# EAGLE design LTC4150 BOB V01 (EAGLE 6.4)
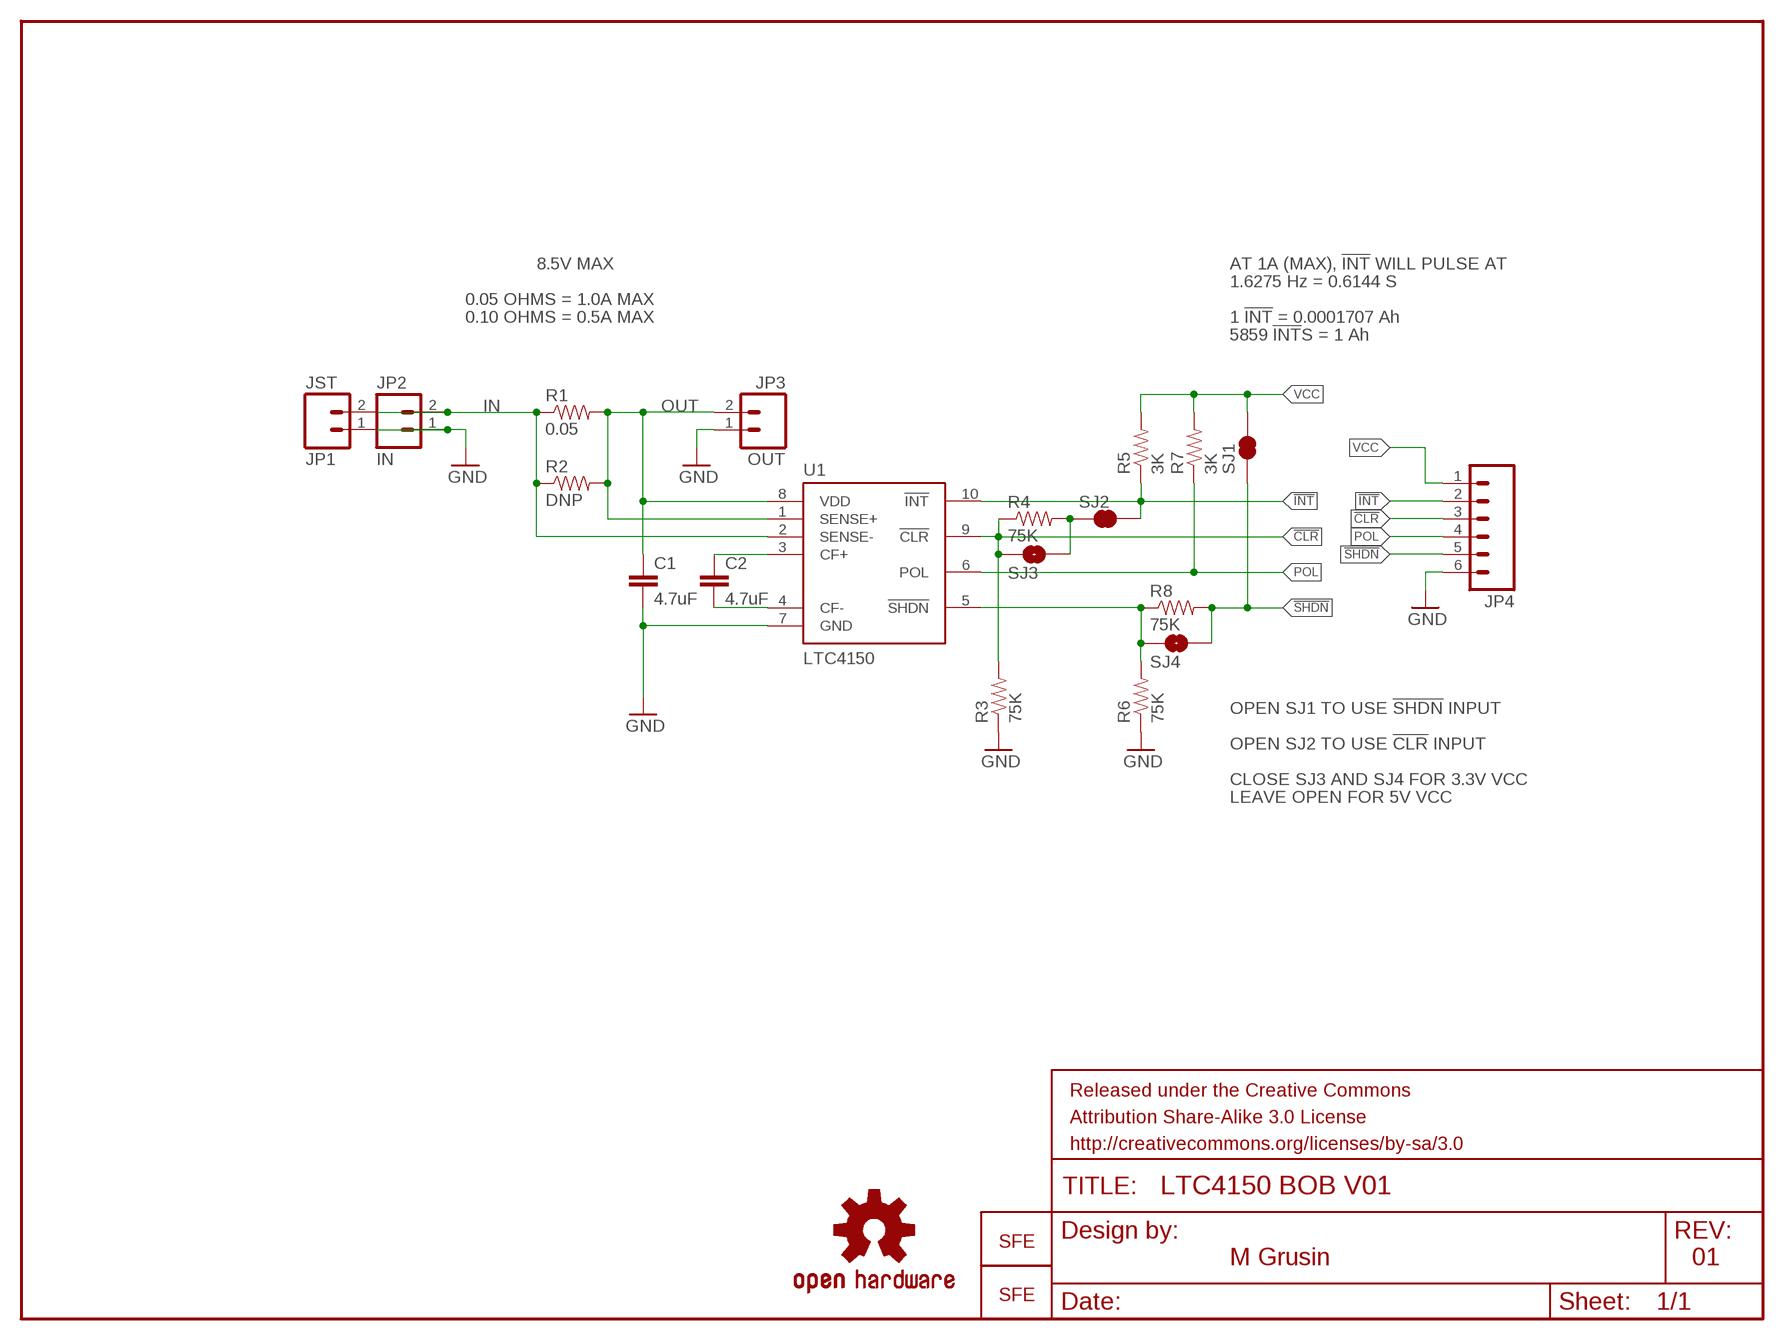
[diagram p0: schematic, sheet 1]

## Parts
C1  4.7uF  CAP0603-CAP  [0603-CAP]
C2  4.7uF  CAP0603-CAP  [0603-CAP]
FRAME1  FRAME-LETTER  [CREATIVE_COMMONS]
JP1  JST  M02-JST-2MM-SMT  [JST-2-SMD]
JP2  IN  M02PTH  [1X02]
JP3  OUT  M02PTH  [1X02]
JP4  M06SIP  [1X06]
LOGO1  OSHW-LOGOS  [OSHW-LOGO-S]
LOGO2  LOGO-SFENW2  [SFE-NEW-WEB]
LOGO3  LOGO-SFESK  [SFE-LOGO-FLAME]
R1  0.05  RESISTOR0805-RES  [0805]
R2  DNP  RESISTORAXIAL-0.3  [AXIAL-0.3]
R3  75K  RESISTOR0603-RES  [0603-RES]
R4  75K  RESISTOR0603-RES  [0603-RES]
R5  3K  RESISTOR0603-RES  [0603-RES]
R6  75K  RESISTOR0603-RES  [0603-RES]
R7  3K  RESISTOR0603-RES  [0603-RES]
R8  75K  RESISTOR0603-RES  [0603-RES]
SJ1  SOLDERJUMPERNC  [SJ_2S]
SJ2  SOLDERJUMPERNC  [SJ_2S]
SJ3  SOLDERJUMPERNO  [SJ_2S-NO]
SJ4  SOLDERJUMPERNO  [SJ_2S-NO]
U1  LTC4150  [MSOP10]

## Nets
!CLR!: JP4.3 R3.2 R4.1 SJ3.1 U1.9(!CLR!)
!INT!: JP4.2 R5.1 SJ2.2 U1.10(!INT!)
!SHDN!: JP4.5 R8.2 SJ1.2 SJ4.2
GND: C1.2 JP1.1 JP2.1 JP3.1 JP4.6 R3.1 R6.1 U1.7(GND)
IN: JP1.2 JP2.2 R1.1 R2.P$1 U1.2(SENSE-)
N$1: R4.2 SJ2.1 SJ3.2
N$3: C2.1 U1.3(CF+)
N$4: C2.2 U1.4(CF-)
N$9: R6.2 R8.1 SJ4.1 U1.5(!SHDN!)
OUT: C1.1 JP3.2 R1.2 R2.P$2 U1.1(SENSE+) U1.8(VDD)
POL: JP4.4 R7.1 U1.6(POL)
VCC: JP4.1 R5.2 R7.2 SJ1.1

## Notes on the sheet
- 8.5V MAX | AT 1A (MAX), !INT! WILL PULSE AT
- 1.6275 Hz = 0.6144 S
- 0.05 OHMS = 1.0A MAX
- 0.10 OHMS = 0.5A MAX | 1 !INT! = 0.0001707 Ah
- 5859 !INT!S = 1 Ah
- OPEN SJ1 TO USE !SHDN! INPUT
- OPEN SJ2 TO USE !CLR! INPUT
- CLOSE SJ3 AND SJ4 FOR 3.3V VCC
- LEAVE OPEN FOR 5V VCC
- M Grusin | 01

## Library data of the parts
C1 C2 = SparkFun-Passives:CAP: Capacitor Standard 0603 ceramic capacitor, and 0.1" leaded capacitor.
FRAME1 = SparkFun-Aesthetics:FRAME-LETTER: Schematic Frame Standard 8.5x11 US Letter frame
JP1 = SparkFun-Connectors:M02: Standard 2-pin 0.1" header. Use with - straight break away headers ( PRT-00116) - right angle break away headers (PRT-00553) - swiss pins (PRT-00743) - machine pins (PRT-00117) - female headers (PRT-00115) Molex polarized connector foot print use with: PRT-08233 with associated crimp pins and housings. 2.54_SCREWTERM for use with PRT-10571. 3.5mm Screw Terminal footprints for PRT-08084 5mm Screw Terminal footprints for use with PRT-08433; PROD_ID: CONN-08352
JP2 JP3 = SparkFun-Connectors:M02: Standard 2-pin 0.1" header. Use with - straight break away headers ( PRT-00116) - right angle break away headers (PRT-00553) - swiss pins (PRT-00743) - machine pins (PRT-00117) - female headers (PRT-00115) Molex polarized connector foot print use with: PRT-08233 with associated crimp pins and housings. 2.54_SCREWTERM for use with PRT-10571. 3.5mm Screw Terminal footprints for PRT-08084 5mm Screw Terminal footprints for use with PRT-08433
JP4 = SparkFun-Connectors:M06: Header 6 Standard 6-pin 0.1" header. Use with straight break away headers (SKU : PRT-00116), right angle break away headers (PRT-00553), swiss pins (PRT-00743), machine pins (PRT-00117), and female headers (PRT-00115). Molex polarized connector foot print use with SKU : PRT-08094 with associated crimp pins and housings. NOTES ON THE VARIANTS LOCK and LOCK_LONGPADS... This footprint was designed to help hold the alignment of a through-hole component (i.e. 6-pin header) while soldering it into place. You may notice that each hole has been shifted either up or down by 0.005 of an inch from it's more standard position (which is a perfectly straight line). This slight alteration caused the pins (the squares in the middle) to touch the edges of the holes. Because they are alternating, it causes a "brace" to hold the component in place. 0.005 has proven to be the perfect amount of "off-center" position when using our standard breakaway headers. Although looks a little odd when you look at the bare footprint, once you have a header in there, the alteration is very hard to notice. Also,if you push a header all the way into place, it is covered up entirely on the bottom side. This idea of altering the position of holes to aid alignment will be further integrated into the Sparkfun Library for other footprints. It can help hold any component with 3 or more connection pins.
LOGO1 = SparkFun-Aesthetics:OSHW-LOGO: Open Source Hardware Logo This logo indicates the piece of hardware it is found on incorporates a OSHW license and/or adheres to the definition of open source hardware found here: http://freedomdefined.org/OSHW
LOGO2 LOGO3 = SparkFun-Aesthetics:LOGO-SFE: Spark Fun Electronics PCB Logo This is the standard Spark Fun Electronics PCB logo.
R1-R8 = SparkFun-Passives:RESISTOR: Resistor Basic schematic elements and footprints for 0603, 1206, and PTH resistors.
SJ1 SJ3 SJ4 = mike-temp:SOLDERJUMPER: Solder Jumper Standard SMD solder jumper. Used to automate production. Two varients : Normally Open and Normally Closed are the same, but have different paste layers. NC will have a large amount of paste and should jumper during reflow.
SJ2 = SparkFun-Passives:SOLDERJUMPER: Solder Jumper Standard SMD solder jumper. Used to automate production. Two varients : Normally Open and Normally Closed are the same, but have different paste layers. NC will have a large amount of paste and should jumper during reflow.
U1 = mike-temp:LTC4150

## Board
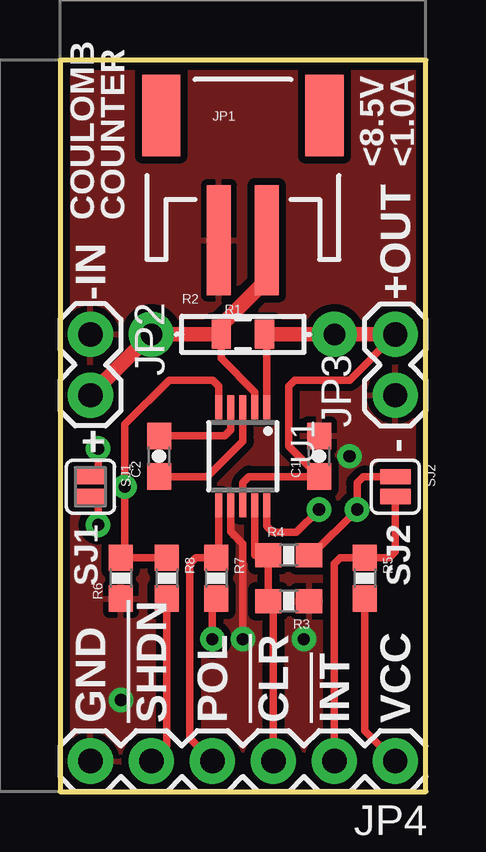
[diagram p1: board, top side]
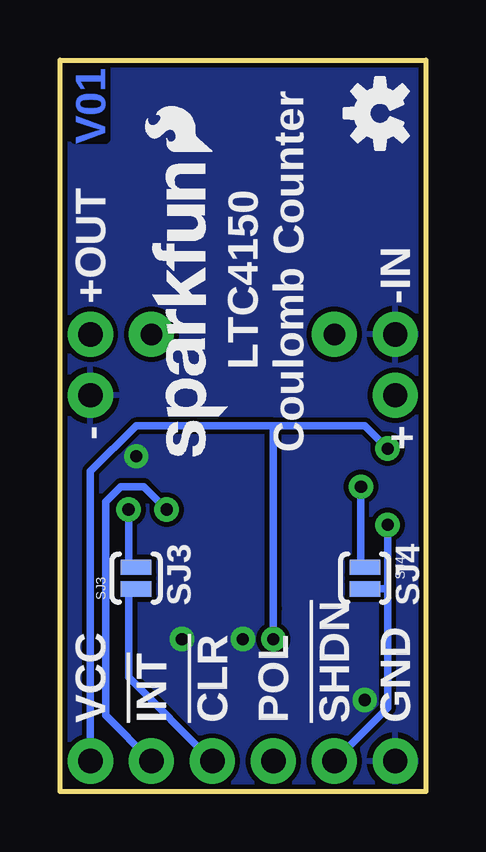
[diagram p2: board, bottom side, seen from below]

Size 15.24 x 30.48 mm. Coordinates in mm from the lower left corner, seen from the top.
Outline: 0,0 15.24,0 15.24,30.48 0,30.48 0,0
Copper layers (1*16): Top 0.035mm / dielectric 1.5mm / Bottom 0.035mm
Design rules "SparkFun": minimum track width 7mil, minimum drill 15mil, track to track 8mil, track to pad 8mil, pad to pad 8mil, via to via 8mil, smd to smd 8mil, copper to edge 8mil, drill to drill 8mil, minimum pad ring 12mil, minimum via ring 10mil, stop-mask expansion 4mil, vias tented up to drill 20mil, thermal gap 10mil

### Footprints (pad centres in the part's own frame; a part is rotated, then mirrored left to right if it is on the bottom)
0603-CAP = smd 1.1 x 1: 1 -0.85,0; 2 0.85,0
JST-2-SMD = smd 1 x 4.6: 1 -1,-3.7; 2 1,-3.7 | smd 1.6 x 3.4: NC1 -3.4,1.5; NC2 3.4,1.5
1X02 = drill 1.016 pad 1.88: 1 0,0; 2 2.54,0
1X06 = drill 1.016 pad 1.88: 1 0,0; 2 2.54,0; 3 5.08,0; 4 7.62,0; 5 10.16,0; 6 12.7,0
0805 = smd 0.8 x 1.2: 1 -0.9,0; 2 0.9,0
AXIAL-0.3 = drill 0.9 pad 1.88: P$1 -3.81,0; P$2 3.81,0
0603-RES = smd 1.1 x 1: 1 -0.85,0; 2 0.85,0
SJ_2S = smd 0.635 x 1.27: 1 -0.412,0; 2 0.412,0
SJ_2S-NO = smd 0.635 x 1.27: 1 -0.45,0; 2 0.45,0
MSOP10 = smd 0.3 x 1: 1 -1,-2.05; 2 -0.5,-2.05; 3 0,-2.05; 4 0.5,-2.05; 5 1,-2.05; 6 1,2.05; 7 0.5,2.05; 8 0,2.05; 9 -0.5,2.05; 10 -1,2.05

### Placement (x,y rotation side)
C1  10.79,13.97 90 top
C2  4.13,13.97 90 top
FRAME1  -25.4,-11.43 0 top  (outside the outline)
JP1  7.62,26.67 0 top
JP2  1.27,19.05 270 top
JP3  13.97,16.51 90 top
JP4  13.97,1.27 180 top
LOGO1  1.91,28.26 90 bottom
LOGO2  8.26,13.97 90 bottom
LOGO3  8.89,26.67 90 bottom
R1  7.62,19.05 0 top
R2  7.62,19.05 0 top
R3  9.53,7.94 180 top
R4  9.53,9.84 0 top
R5  12.7,8.89 270 top
R6  2.54,8.89 90 top
R7  6.51,8.89 270 top
R8  4.45,8.89 270 top
SJ1  1.27,12.7 270 top
SJ2  13.97,12.7 270 top
SJ3  12.06,8.89 90 bottom
SJ4  2.54,8.89 270 bottom
U1  7.62,13.97 180 top

### Tracks (layer width: path | path; a pad name or v marks a point on that pad's centre or on a via)
!CLR!
  Top 0.305: U1.9 8.12,9.84 R4.1 R3.2 8.89,7.72 JP4.3
  Bottom 0.305: JP4.3 12.38,4.76 12.38,8.44 SJ3.1
!INT!  (via drill 0.51)
  Top 0.305: JP4.2 11.43,9.49 11.68,9.74 R5.1 13.72,9.74 13.97,9.99 SJ2.2 14.35,12.29 | U1.10 8.62,11.05 8.87,10.79 9.84,10.79 v10.79,11.75
  Bottom 0.305: v10.79,11.75 11.75,12.7 12.7,12.7 13.34,12.06 13.34,4.45 13.34,3.17 JP4.2
!SHDN!  (via drill 0.51)
  Top 0.305: SJ1.2 1.59,12.29 1.59,12.06 v1.59,11.11 | R8.2 4.45,1.91 JP4.5
  Bottom 0.305: JP4.5 1.91,3.17 1.59,3.49 1.59,7.62 1.59,8.89 | 1.59,8.89 v1.59,11.11 | SJ4.2 1.59,8.44 1.59,8.89
GND  (via drill 0.51)
  Top 0.305: U1.7 7.12,10.82 7.62,10.32 v7.62,6.35
  other vias: 10.16,6.35 2.54,3.81 12.06,13.97
  pour Top (isolate 0.305): 0,30.48 15.24,30.48 15.24,0 0,0
  pour Bottom: 0,30.48 15.24,30.48 15.24,0 0,0
IN
  Top 0.305: R1.1 6.72,18.05 8.12,16.64 U1.2
  Top 0.61: JP1.2 8.62,21.32 6.72,19.42 R1.1 R2.P$1 JP2.2
N$1  (via drill 0.51)
  Top 0.305: SJ2.1 12.64,13.11 12.38,12.86 v12.38,11.75 10.48,9.84 R4.2
  Bottom 0.305: SJ3.2 12.38,9.34 v12.38,11.75
N$3
  Top 0.305: C2.1 6.13,13.12 7.62,14.61 U1.3
N$4
  Top 0.305: C2.2 6.87,14.82 7.12,15.07 U1.4
N$9  (via drill 0.51)
  Top 0.305: R8.1 2.7,9.74 | 2.7,9.74 R6.2 2.7,9.74 | U1.5 6.62,16.89 6.37,17.14 4.55,17.14 2.7,15.3 v2.7,12.7 2.7,11.43 2.7,9.74
  Bottom 0.305: SJ4.1 2.7,9.34 2.7,9.37 v2.7,12.7
OUT
  Top 0.305: U1.8 7.62,12.87 7.87,13.12 C1.1 9.53,14.39 9.53,16.89 9.78,17.14 12.06,17.14 JP3.2 | U1.1 8.62,18.95 R1.2
  Top 0.61: R1.2 R2.P$2 JP3.2
POL
  Top 0.305: U1.6 6.62,9.74 R7.1 5.65,9.74 5.4,9.49 5.4,2.22 JP4.4
VCC  (via drill 0.51)
  Top 0.305: R5.2 12.7,2.54 JP4.1 | R7.2 6.35,8.04 6.35,7.94 v6.35,6.35 | SJ1.1 1.59,13.11 v1.59,14.29
  Bottom 0.305: v6.35,6.35 6.35,7.62 6.35,15.24 | 6.35,15.24 12.06,15.24 13.97,13.34 JP4.1 | 6.35,15.24 2.54,15.24 v1.59,14.29

### Text on the board
Bottom: V01
tPlace: <8.5V | <1.0A | COULOMB | COUNTER | -IN | +OUT | + | - | SJ1 | SJ2 | GND | !SHDN! | POL | !CLR! | !INT! | VCC
bPlace: Coulomb Counter | LTC4150 | -IN | +OUT | + | - | SJ4 | SJ3 | GND | !SHDN! | POL | !CLR! | !INT! | VCC
tValues: M Grusin